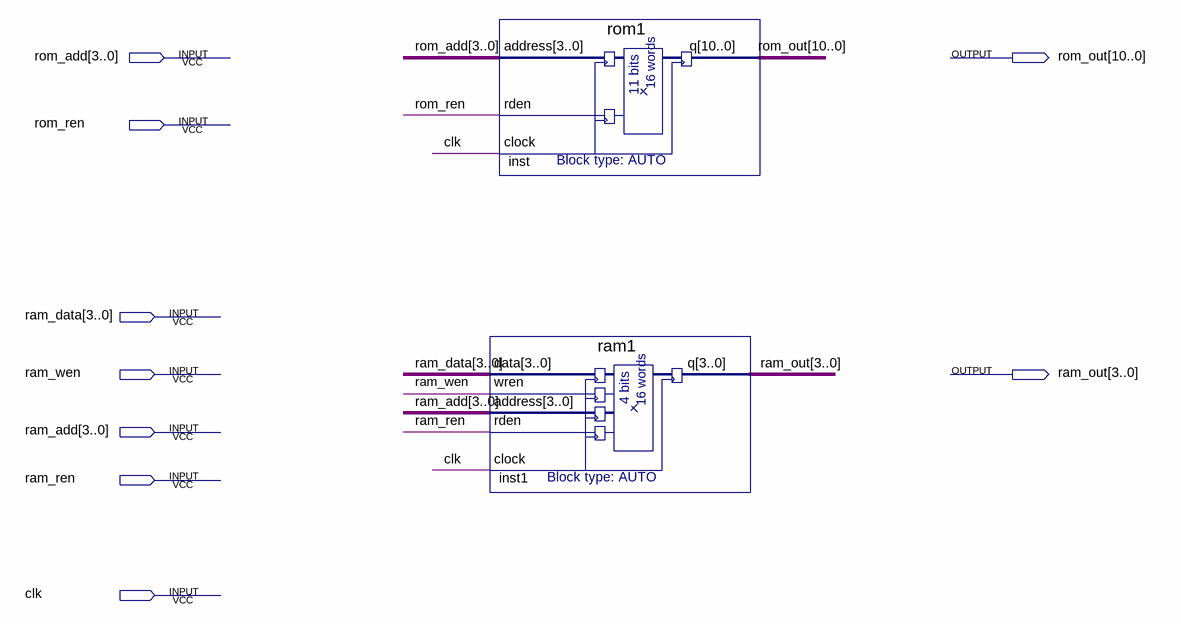
[diagram p0: schematic sheet]
// Quartus schematic Memory_Design_With_Quartus.bdf as structural Verilog: 2 symbols, 9 pins
module Memory_Design_With_Quartus (
  input  [3:0] rom_add,
  input  rom_ren,
  input  [3:0] ram_data,
  input  ram_wen,
  input  [3:0] ram_add,
  input  ram_ren,
  input  clk,
  output [10:0] rom_out,
  output [3:0] ram_out
);

  rom1 inst (.address(rom_add), .rden(rom_ren), .clock(clk), .q(rom_out));
  ram1 inst1 (.data(ram_data), .wren(ram_wen), .address(ram_add), .rden(ram_ren), .clock(clk), .q(ram_out));
endmodule
